# EAGLE schematic MCP73832_BOB (EAGLE 6.4)
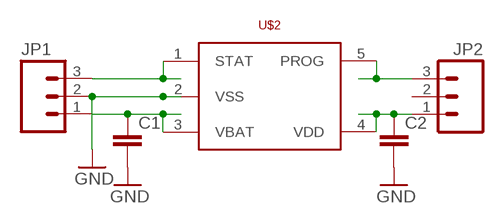
[diagram p0: schematic, sheet 1]

## Parts
C1  CAP1206  [1206]
C2  CAP1206  [1206]
JP1  M03LOCK  [1X03_LOCK]
JP2  M03LOCK  [1X03_LOCK]
U$2  MCP73832  [SOT-23(OT)5_LEAD]

## Nets
GND: C1.2 C2.2 JP1.2 U$2.2(VSS)
N$1: C1.1 JP1.1 U$2.3(VBAT)
N$3: JP1.3 U$2.1(STAT)
N$4: JP2.3 U$2.5(PROG)
N$5: C2.1 JP2.1 U$2.4(VDD)
Unconnected: JP2.2

## Library data of the parts
C1 C2 = SparkFun:CAP: Capacitor Standard 0603 ceramic capacitor, and 0.1" leaded capacitor.
JP1 JP2 = SparkFun:M03: Header 3 Standard 3-pin 0.1" header. Use with straight break away headers (SKU : PRT-00116), right angle break away headers (PRT-00553), swiss pins (PRT-00743), machine pins (PRT-00117), and female headers (PRT-00115). Molex polarized connector foot print use with SKU : PRT-08232 with associated crimp pins and housings.
U$2 = ERIC:MCP73832: Lithium Ion/Lithium Polymer Charge Management Controller

## Net classes
0 default: width 0.4 mm, clearance 0.3 mm